# EAGLE design asset-tracker-v004 (EAGLE 7.6.0)
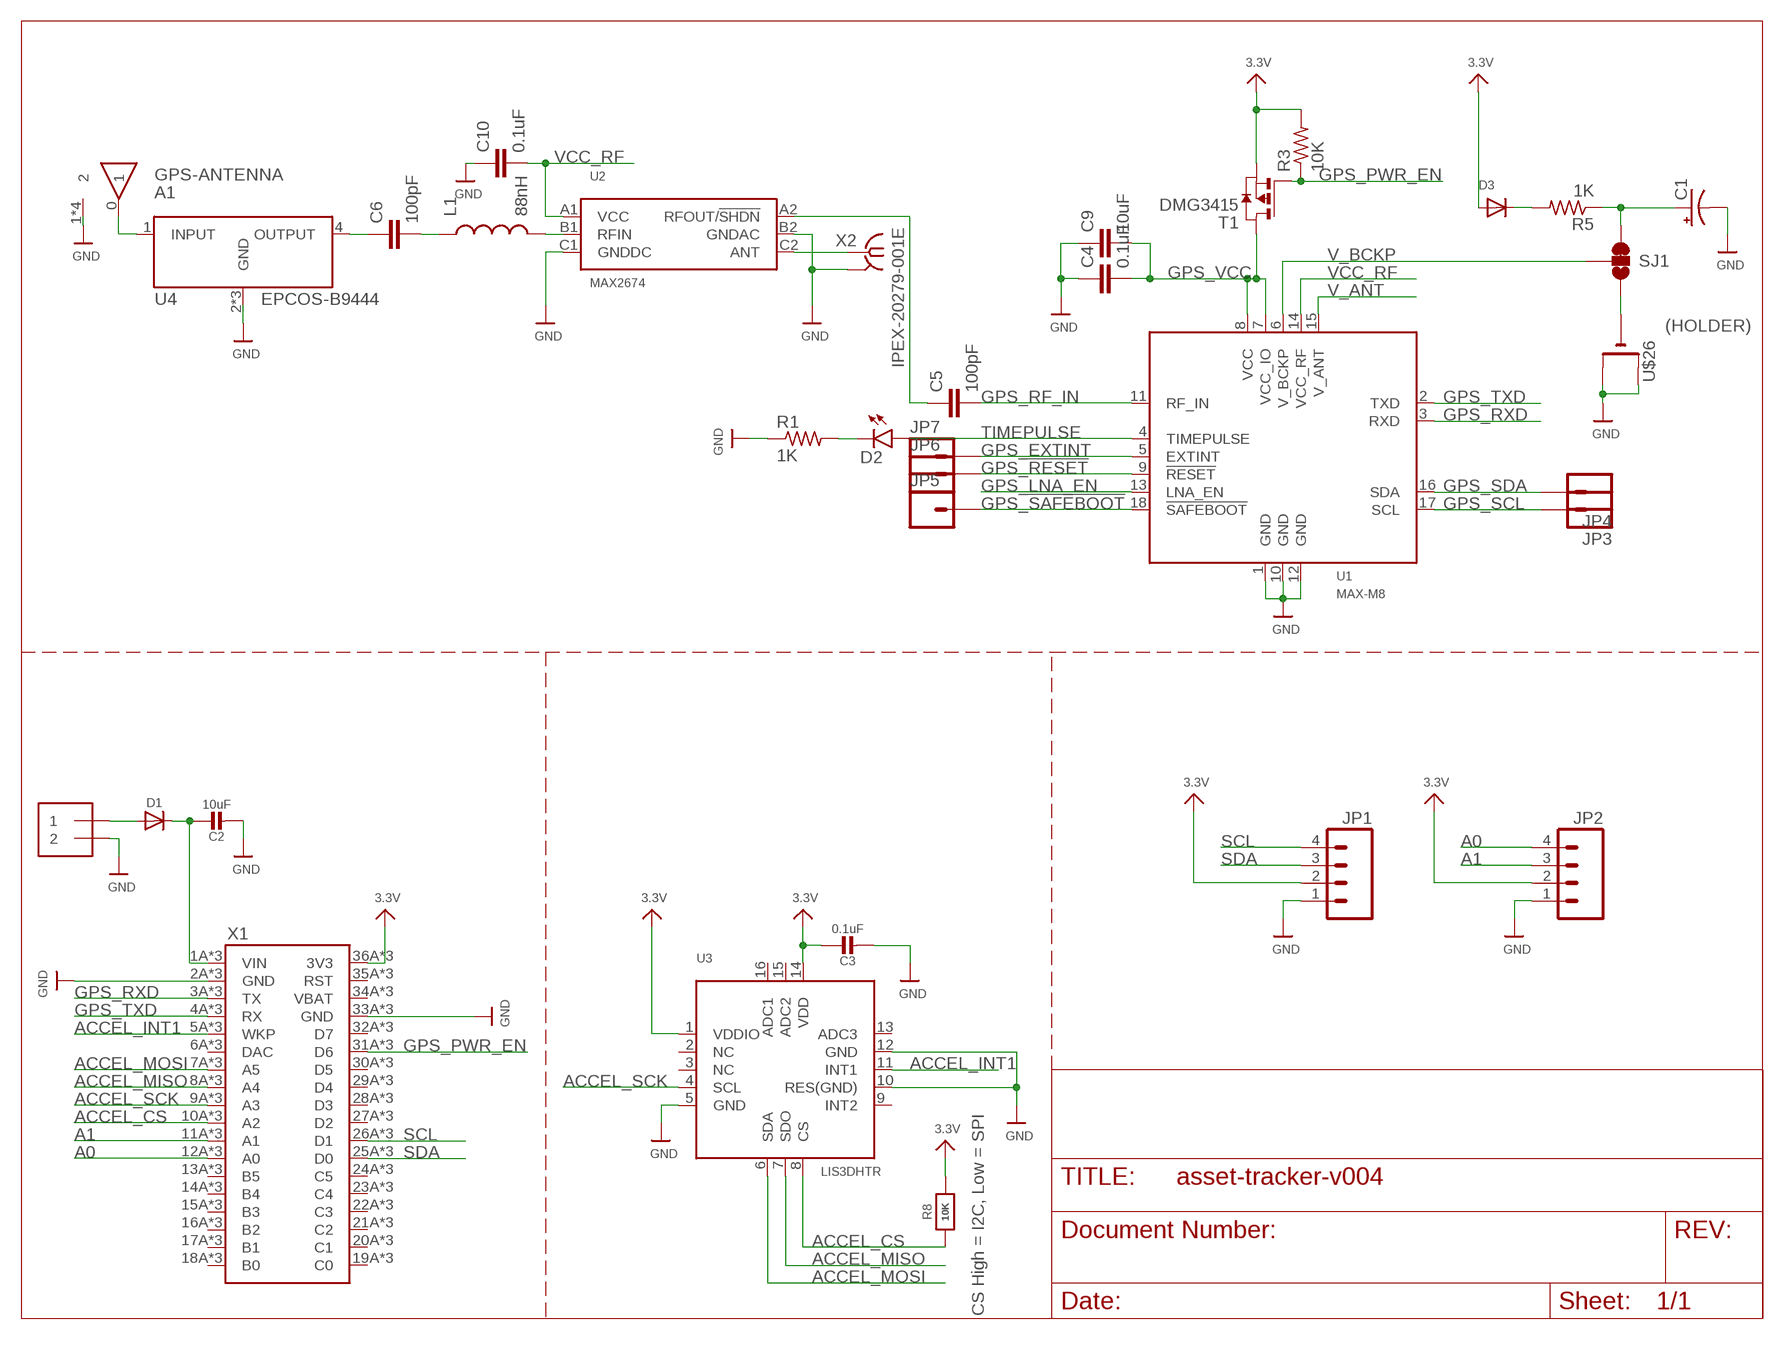
[diagram p0: schematic, sheet 1]

## Parts
A1  GPS-ANTENNA  [ANT1818B00BT1516S]
C1  SUPERCAP  [414-VA5R]
C2  10uF  CAP_CERAMIC_0402MP  [_0402MP]
C3  0.1uF  CAP_CERAMIC_0402MP  [_0402MP]
C4  0.1uF  C-EUC0402  [C0402]
C5  100pF  C-EUC0402  [C0402]
C6  100pF  C-EUC0402  [C0402]
C9  10uF  C-EUC0402  [C0402]
C10  0.1uF  C-EUC0402  [C0402]
D1  DIODESMA  [SMADIODE]
D2  LED0603  [LED-0603]
D3  DIODESOD-523  [SOD-523]
J1  1X2-3.5MM  [1X2-3.5MM]
JP1  M04JST-PTH-VERT  [JST-4-PTH-VERT]
JP2  M04JST-PTH-VERT  [JST-4-PTH-VERT]
JP3  M01NOSILK-KIT  [1X01NS-KIT]
JP4  M01NOSILK-KIT  [1X01NS-KIT]
JP5  M01NOSILK-KIT  [1X01NS-KIT]
JP6  M01NOSILK-KIT  [1X01NS-KIT]
JP7  M01NOSILK-KIT  [1X01NS-KIT]
L1  88nH  INDUCTOR-SPARKFUN0402  [C0402]
R1  1K  R-US_R0402  [R0402]
R3  10K  R-US_R0402  [R0402]
R5  1K  R-US_R0402  [R0402]
R8  10K  RESISTOR_0402MP  [_0402MP]
SJ1  JUMPER-PAD-3-2OF3_NC_BY_TRACE_LARGE  [PAD-JUMPER-3-2OF3_NC_BY_TRACE_YES_SILK_LARGE]
T1  DMG3415  PMOSSOT23  [SOT-23]
U1  MAX-M8  [MAX-M8]
U2  MAX2674  [WLP-6]
U3  LIS3DHTR  ACCEL_LIS3DHTR  [LGA16_3X3MM]
U4  EPCOS-B9444  [QCS5I]
U$26  CR2032SMT  [CR2032-SMD]
X1  ELECTRON  ELECTRON_SMT  [ELECTRON_SMT]
X2  IPEX-20279-001E  [IPEX-20279-001E]

## Nets
3.3V: C3.1 D3.A JP1.2 JP2.2 R3.2 R8.2 T1.2(S) U3.1(VDDIO) U3.14(VDD) X1.36A(3V3) X1.36B(3V3) X1.36C(3V3)
A0: JP2.4 X1.12A(A0) X1.12B(A0) X1.12C(A0)
A1: JP2.3 X1.11A(A1) X1.11B(A1) X1.11C(A1)
ACCEL_CS: R8.1 U3.8(CS) X1.10A(A2) X1.10B(A2) X1.10C(A2)
ACCEL_INT1: U3.11(INT1) X1.5A(WKP) X1.5B(WKP) X1.5C(WKP)
ACCEL_MISO: U3.7(SDO) X1.8A(A4) X1.8B(A4) X1.8C(A4)
ACCEL_MOSI: U3.6(SDA) X1.7A(A5) X1.7B(A5) X1.7C(A5)
ACCEL_SCK: U3.4(SCL) X1.9A(A3) X1.9B(A3) X1.9C(A3)
GND: A1.1 A1.2 A1.3 A1.4 C1.- C2.2 C3.2 C4.1 C9.1 C10.1 J1.2 JP1.1 JP2.1 R1.1 U1.1(GND) U1.10(GND) U1.12(GND) U2.B2(GNDAC) U2.C1(GNDDC) U3.5(GND) U3.10(RES(GND)) U3.12(GND) U4.2(GND) U4.3(GND) U4.5(GND) U$26.+$1(+) U$26.+$2(+1) X1.2A(GND) X1.2B(GND) X1.2C(GND) X1.33A(GND) X1.33B(GND) X1.33C(GND) X2.2@1(GND) X2.2@2(GND)
GPS_!RESET: JP6.1 U1.9(!RESET)
GPS_!SAFEBOOT: JP5.1 U1.18(!SAFEBOOT)
GPS_EXTINT: JP7.1 U1.5(EXTINT)
GPS_LNA_EN: U1.13(LNA_EN)
GPS_PWR_EN: R3.1 T1.3(G) X1.31A(D6) X1.31B(D6) X1.31C(D6)
GPS_RF_IN: C5.2 U1.11(RF_IN)
GPS_RXD: U1.3(RXD) X1.3A(TX) X1.3B(TX) X1.3C(TX)
GPS_SCL: JP3.1 U1.17(SCL)
GPS_SDA: JP4.1 U1.16(SDA)
GPS_TXD: U1.2(TXD) X1.4A(RX) X1.4B(RX) X1.4C(RX)
GPS_VCC: C4.2 C9.2 T1.1(D) U1.7(VCC_IO) U1.8(VCC)
N$1: C6.1 U4.4(OUTPUT)
N$2: L1.2 U2.B1(RFIN)
N$3: C6.2 L1.1
N$4: C5.1 U2.A2(RFOUT/!SHDN)
N$5: U2.C2(ANT) X2.1
N$6: D2.C R1.2
N$7: C1.+ R5.1 SJ1.3
N$8: C2.1 D1.C X1.1A(VIN) X1.1B(VIN) X1.1C(VIN)
N$9: D1.A J1.1
N$10: D3.K(C) R5.2
N$11: SJ1.1 U$26.-
N$12: A1.0 U4.1(INPUT)
SCL: JP1.4 X1.26A(D1) X1.26B(D1) X1.26C(D1)
SDA: JP1.3 X1.25A(D0) X1.25B(D0) X1.25C(D0)
TIMEPULSE: D2.A U1.4(TIMEPULSE)
V_ANT: U1.15(V_ANT)
V_BCKP: SJ1.2 U1.6(V_BCKP)
VCC_RF: C10.2 U1.14(VCC_RF) U2.A1(VCC)
Unconnected: U3.2(NC) U3.3(NC) U3.9(INT2) U3.13(ADC3) U3.15(ADC2) U3.16(ADC1) X1.6A(DAC) X1.6B(DAC) X1.6C(DAC) X1.13A(B5) X1.13B(B5) X1.13C(B5) X1.14A(B4) X1.14B(B4) X1.14C(B4) X1.15A(B3) X1.15B(B3) X1.15C(B3) X1.16A(B2) X1.16B(B2) X1.16C(B2) X1.17A(B1) X1.17B(B1) X1.17C(B1) X1.18A(B0) X1.18B(B0) X1.18C(B0) X1.19A(C0) X1.19B(C0) X1.19C(C0) X1.20A(C1) X1.20B(C1) X1.20C(C1) X1.21A(C2) X1.21B(C2) X1.21C(C2) X1.22A(C3) X1.22B(C3) X1.22C(C3) X1.23A(C4) X1.23B(C4) X1.23C(C4) X1.24A(C5) X1.24B(C5) X1.24C(C5) X1.27A(D2) X1.27B(D2) X1.27C(D2) X1.28A(D3) X1.28B(D3) X1.28C(D3) X1.29A(D4) X1.29B(D4) X1.29C(D4) X1.30A(D5) X1.30B(D5) X1.30C(D5) X1.32A(D7) X1.32B(D7) X1.32C(D7) X1.34A(VBAT) X1.34B(VBAT) X1.34C(VBAT) X1.35A(RST) X1.35B(RST) X1.35C(RST)

## Notes on the sheet
- (HOLDER)
- CS High = I2C, Low = SPI

## Library data of the parts
A1 = antenna:GPS-ANTENNA
C1 = adafruit:SUPERCAP
C2 C3 = microbuilder:CAP_CERAMIC: Ceramic Capacitors For new designs, use the packages preceded by an '_' character since they are more reliable: The following footprints should be used on most boards: _0402 - Standard footprint for regular board layouts _0603 - Standard footprint for regular board layouts _0805 - Standard footprint for regular board layouts _1206 - Standard footprint for regular board layouts For extremely tight-pitch boards where space is at a premium, the following 'micro-pitch' footprints can be used (smaller pads, no silkscreen outline, etc.): _0402MP - Micro-pitch footprint for very dense/compact boards _0603MP - Micro-pitch footprint for very dense/compact boards _0805MP - Micro-pitch footprint for very dense/compact boards _1206MP - Micro-pitch footprint for very dense/compact boards
C4-C6 C9 C10 = rcl:C-EU: CAPACITOR, European symbol
D1 = microbuilder:DIODE: Diode
D2 = SparkFun-LED:LED: LEDs Standard schematic elements and footprints for 5mm, 3mm, 1206, and 0603 sized LEDs. 5mm - Spark Fun Electronics SKU : COM-00529 (and others)
D3 = adafruit:DIODE: Diode
J1 = adafruit2:1X2: 3.5mm Terminal block http://www.ladyada.net/library/pcb/eaglelibrary.html
JP1 JP2 = SparkFun-Connectors:M04: Header 4 Standard 4-pin 0.1" header. Use with straight break away headers (SKU : PRT-00116), right angle break away headers (PRT-00553), swiss pins (PRT-00743), machine pins (PRT-00117), and female headers (PRT-00115). Molex polarized connector foot print use with SKU : PRT-08231 with associated crimp pins and housings. 1MM SMD Version SKU: PRT-10208
JP3-JP7 = SparkFun-Connectors:M01: Header 1 Standard 1-pin 0.1" header. Use with straight break away headers (SKU : PRT-00116), right angle break away headers (PRT-00553), swiss pins (PRT-00743), machine pins (PRT-00117), and female headers (PRT-00115). SMTSO-256-ET is a "flush mount" nut for a 4-40 screw. The older package used to be too tight, and did not allow it to sit properly thru the drill hit. The latest (0.165DIA) fits nice and snug.
L1 = Particle:INDUCTOR-SPARKFUN: Inductors Basic Inductor/Choke - 0603 and 1206. Footprints are not proven and vary greatly between part numbers. SRN6045- 33uH, 20% 1.4A
R1 R3 R5 = rcl:R-US_: RESISTOR, American symbol
R8 = microbuilder:RESISTOR: Resistors For new designs, use the packages preceded by an '_' character since they are more reliable: The following footprints should be used on most boards: _0402 - Standard footprint for regular board layouts _0603 - Standard footprint for regular board layouts _0805 - Standard footprint for regular board layouts _1206 - Standard footprint for regular board layouts For extremely tight-pitch boards where space is at a premium, the following 'micro-pitch' footprints can be used (smaller pads, no silkscreen outline, etc.): _0402MP - Micro-pitch footprint for very dense/compact boards _0603MP - Micro-pitch footprint for very dense/compact boards _0805MP - Micro-pitch footprint for very dense/compact boards _1206MP - Micro-pitch footprint for very dense/compact boards
SJ1 = SparkFun-Passives:JUMPER-PAD-3-2OF3_NC_BY_TRACE
T1 = zetex:PMOSSOT23: MOS FET; OC_FARNELL: unknown; OC_NEWARK: unknown
U1 = u-blox:MAX-M8
U2 = maxim:MAX2674: GPS/GNSS LNAs with Antenna Switch and Bias
U3 = microbuilder:ACCEL_LIS3DHTR: LIS3DHTR 3-Axis Accelerometer with I2C/SPI Interface VDD: 1.71-3.6V VDDIO: 1.71-VDD+0.1V Scale: +/-2g, 4g, 8g, 16g with 16--bit data output Temp:: -40°C - 85°C Mouser: 511-LIS3DHTR Digikey: 497-10613-1-ND
U4 = filters:EPCOS-B9444
U$26 = adafruit:CR2032
X1 = microbuilder:ELECTRON
X2 = Particle:IPEX-20279-001E: Ultra Miniature Coaxial SMT RF Receptacle

## Board
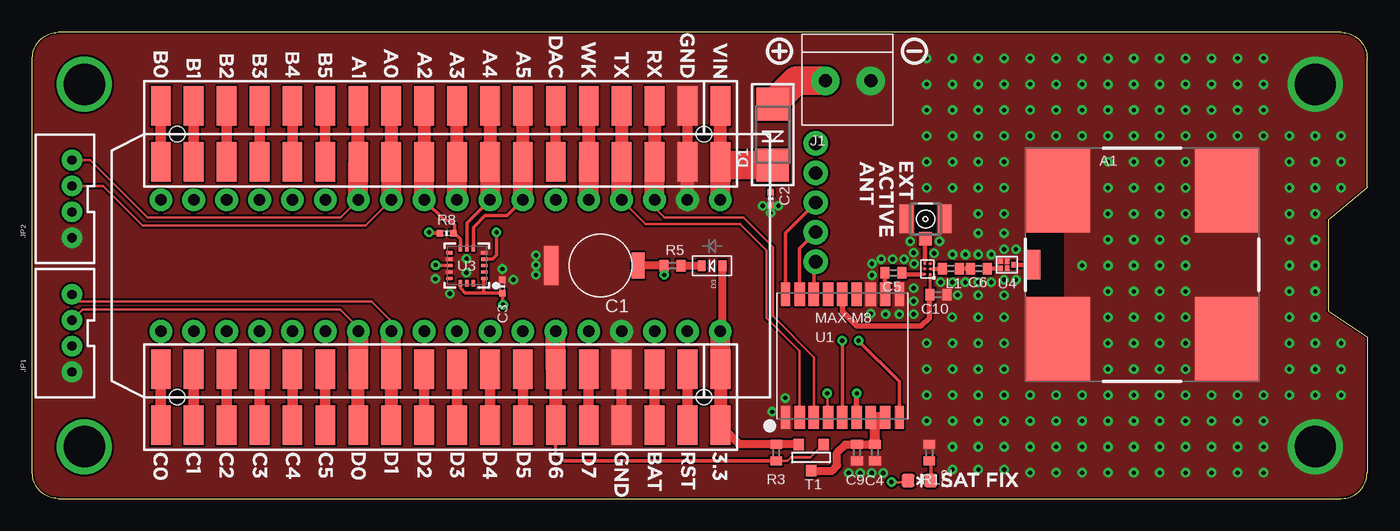
[diagram p1: board, top side]
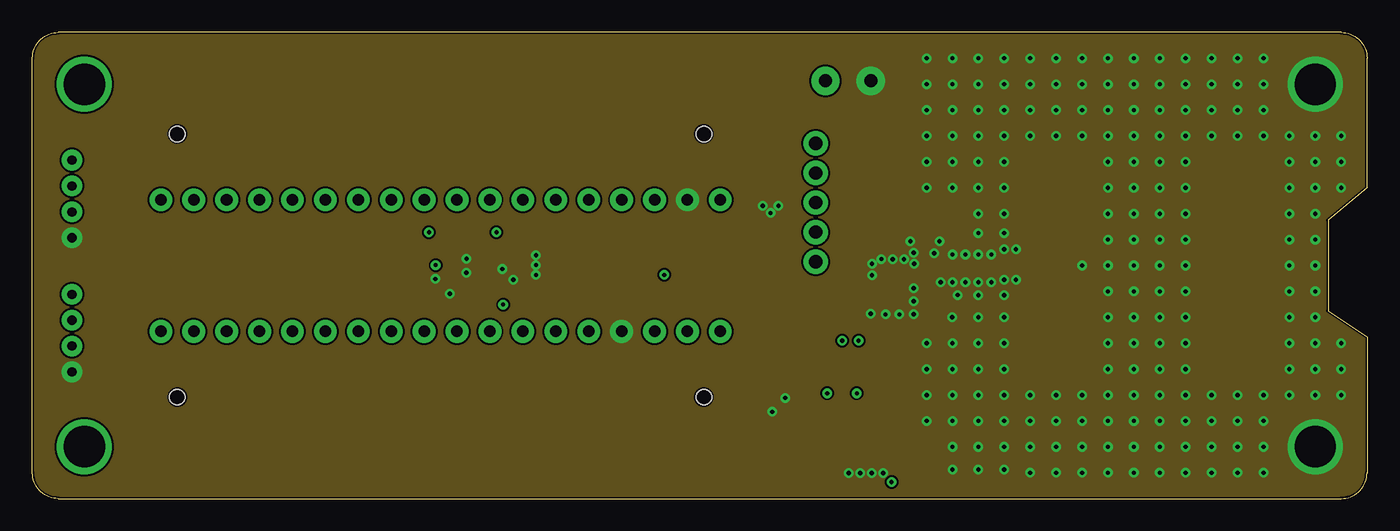
[diagram p2: board, inner layer Route2]
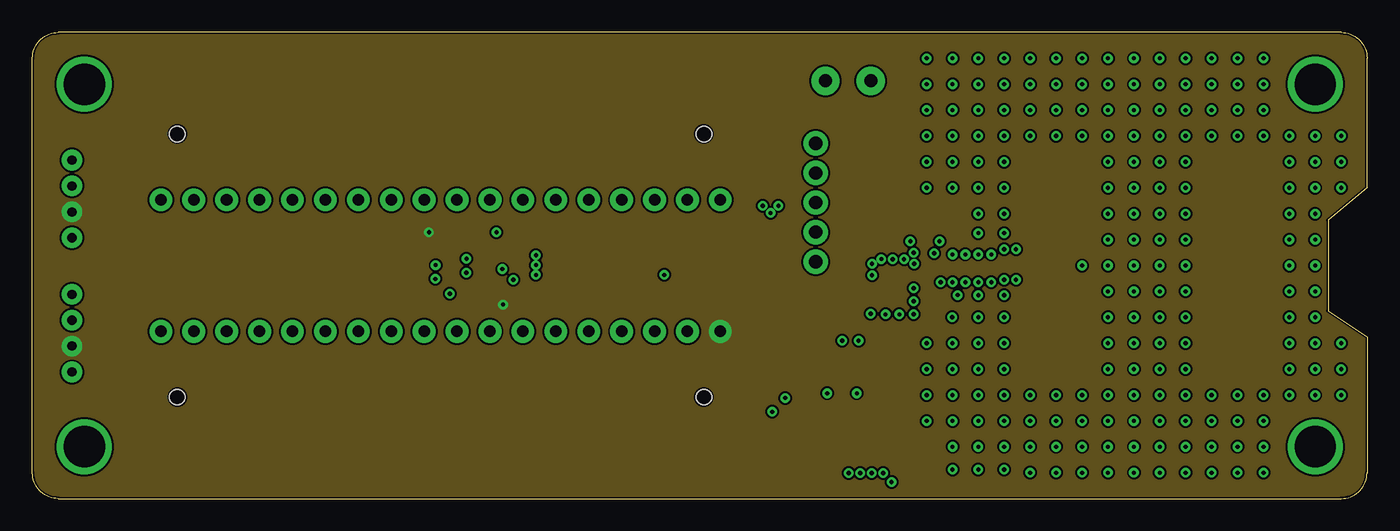
[diagram p3: board, inner layer Route15]
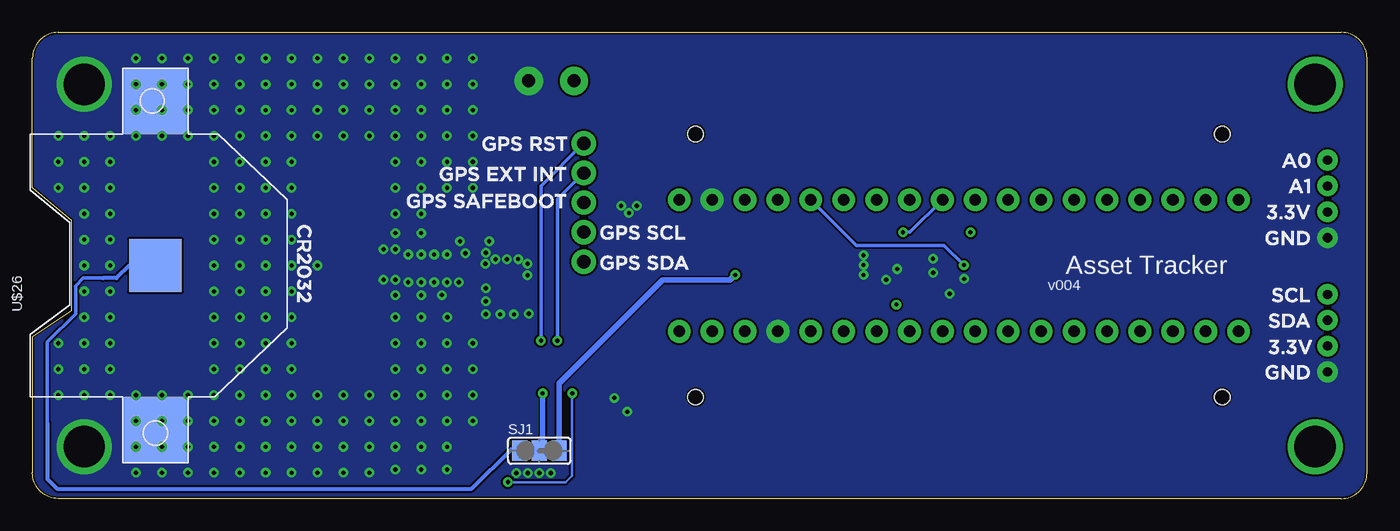
[diagram p4: board, bottom side, seen from below]

Size 103 x 36 mm. Coordinates in mm from the lower left corner, seen from the top.
Outline: 103,2 arc-90 101,0 2,0 arc-90 0,2 0,34 arc-90 2,36 101,36 arc-90 103,34
Outline: 103,34 103,24 100,21.5 100,14.5 103,12.5 103,2
Copper layers (1+2*15+16): Top 0.018mm / dielectric 0.195mm / Route2 0.035mm / dielectric 1.1mm / Route15 0.035mm / dielectric 0.195mm / Bottom 0.018mm
Design rules "spark-4layer": minimum track width 6mil, minimum drill 0.3mm, track to track 6mil, track to pad 6mil, pad to pad 6mil, via to via 6mil, smd to smd 6mil, copper to edge 6mil, drill to drill 6mil, minimum pad ring 12mil, minimum via ring 8mil, stop-mask expansion 4mil, vias tented up to drill 20mil, thermal gap 8mil
tRestrict: area 68.1,20.4 to 69.8,22.8; area 70.7,17.1 to 71.1,18.4; area 72.8,17.1 to 73.3,18.4; area 66.2,16.8 to 66.6,18.1

### Footprints (pad centres in the part's own frame; a part is rotated, then mirrored left to right if it is on the bottom)
ANT1818B00BT1516S = smd 2.3 x 1.2: 0 0,-8.45 | smd 6.5 x 5: 1 -5.75,-6.55; 2 5.75,-6.55; 3 5.75,6.55; 4 -5.75,6.55
414-VA5R = smd 1 x 2: + -2.9,0 | smd 1.1 x 3: - 3.8,0
_0402MP = smd 0.5 x 0.5: 1 -0.508,0; 2 0.508,0
C0402 = smd 0.7 x 0.9: 1 -0.65,0; 2 0.65,0
SMADIODE = smd 2.54 x 2.54: A 2.349,0; C -2.349,0
LED-0603 = smd 1 x 1: A 0,-0.877; C 0,0.877
SOD-523 = smd 0.8 x 0.6: A 0,-0.8; K 0,0.8
1X2-3.5MM = drill 1 pad 2.184: 1 1.8,0; 2 -1.7,0
JST-4-PTH-VERT = drill 0.7 pad 1.6: 1 -3,-0.55; 2 -1,-0.55; 3 1,-0.55; 4 3,-0.55
1X01NS-KIT = drill 1.016 pad 1.88: 1 0,0
R0402 = smd 0.7 x 0.9: 1 -0.65,0; 2 0.65,0
PAD-JUMPER-3-2OF3_NC_BY_TRACE_YES_SILK_LARGE = smd 1.168 x 1.6: 1 -1.524,0; 2 0,0; 3 1.524,0
SOT-23 = smd 0.787 x 0.889: 1 0.025,-1.016; 2 -0.94,1.016; 3 0.991,1.016
MAX-M8 = smd 1.8 x 0.7: 1 4.75,-4.4; 9 4.75,4.4; 10 -4.75,4.4; 18 -4.75,-4.4 | smd 1.8 x 0.8: 2 4.75,-3.3; 3 4.75,-2.2; 4 4.75,-1.1; 5 4.75,0; 6 4.75,1.1; 7 4.75,2.2; 8 4.75,3.3; 11 -4.75,3.3; 12 -4.75,2.2; 13 -4.75,1.1; 14 -4.75,0; 15 -4.75,-1.1; 16 -4.75,-2.2; 17 -4.75,-3.3
WLP-6 = smd 0.229 x 0.229: A1 -0.2,0.4; A2 0.2,0.4; B1 -0.2,0; B2 0.2,0; C1 -0.2,-0.4; C2 0.2,-0.4
LGA16_3X3MM = smd 0.5 x 0.25: 1 -1.35,1; 2 -1.35,0.5; 3 -1.35,0; 4 -1.35,-0.5; 5 -1.35,-1; 9 1.35,-1; 10 1.35,-0.5; 11 1.35,0; 12 1.35,0.5; 13 1.35,1 | smd 0.25 x 0.5: 6 -0.5,-1.35; 7 0,-1.35; 8 0.5,-1.35; 14 0.5,1.35; 15 0,1.35; 16 -0.5,1.35
QCS5I = smd 0.35 x 0.425: 1 -0.5,0; 2 0,-0.287; 3 0.5,-0.287; 4 0.5,0.287; 5 0,0.287
CR2032-SMD = smd 5.08 x 5.08: +$1 -12.7,0; +$2 12.7,0 | smd 4.064 x 4.064: - 0,0
ELECTRON_SMT = smd 3.048 x 1.524: 1A -12.319,21.59; 1B -8.001,21.59; 2A -12.319,19.05; 2B -8.001,19.05; 3A -12.319,16.51; 3B -8.001,16.51; 4A -12.319,13.97; 4B -8.001,13.97; 5A -12.319,11.43; 5B -8.001,11.43; 6A -12.319,8.89; 6B -8.001,8.89; 7A -12.319,6.35; 7B -8.001,6.35; 8A -12.319,3.81; 8B -8.001,3.81; 9A -12.319,1.27; 9B -8.001,1.27; 10A -12.319,-1.27; 10B -8.001,-1.27; 11A -12.319,-3.81; 11B -8.001,-3.81; 12A -12.319,-6.35; 12B -8.001,-6.35; 13A -12.319,-8.89; 13B -8.001,-8.89; 14A -12.319,-11.43; 14B -8.001,-11.43; 15A -12.319,-13.97; 15B -8.001,-13.97; 16A -12.319,-16.51; 16B -8.001,-16.51; 17A -12.319,-19.05; 17B -8.001,-19.05; 18A -12.319,-21.59; 18B -8.001,-21.59; 19A 12.319,-21.59; 19B 8.001,-21.59; 20A 12.319,-19.05; 20B 8.001,-19.05; 21A 12.319,-16.51; 21B 8.001,-16.51; 22A 12.319,-13.97; 22B 8.001,-13.97; 23A 12.319,-11.43; 23B 8.001,-11.43; 24A 12.319,-8.89; 24B 8.001,-8.89; 25A 12.319,-6.35; 25B 8.001,-6.35; 26A 12.319,-3.81; 26B 8.001,-3.81; 27A 12.319,-1.27; 27B 8.001,-1.27; 28A 12.319,1.27; 28B 8.001,1.27; 29A 12.319,3.81; 29B 8.001,3.81; 30A 12.319,6.35; 30B 8.001,6.35; 31A 12.319,8.89; 31B 8.001,8.89; 32A 12.319,11.43; 32B 8.001,11.43; 33A 12.319,13.97; 33B 8.001,13.97; 34A 12.319,16.51; 34B 8.001,16.51; 35A 12.319,19.05; 35B 8.001,19.05; 36A 12.319,21.59; 36B 8.001,21.59 | drill 0.889 pad 1.753: 1C -5.08,21.59; 2C -5.08,19.05; 3C -5.08,16.51; 4C -5.08,13.97; 5C -5.08,11.43; 6C -5.08,8.89; 7C -5.08,6.35; 8C -5.08,3.81; 9C -5.08,1.27; 10C -5.08,-1.27; 11C -5.08,-3.81; 12C -5.08,-6.35; 13C -5.08,-8.89; 14C -5.08,-11.43; 15C -5.08,-13.97; 16C -5.08,-16.51; 17C -5.08,-19.05; 18C -5.08,-21.59; 19C 5.08,-21.59; 20C 5.08,-19.05; 21C 5.08,-16.51; 22C 5.08,-13.97; 23C 5.08,-11.43; 24C 5.08,-8.89; 25C 5.08,-6.35; 26C 5.08,-3.81; 27C 5.08,-1.27; 28C 5.08,1.27; 29C 5.08,3.81; 30C 5.08,6.35; 31C 5.08,8.89; 32C 5.08,11.43; 33C 5.08,13.97; 34C 5.08,16.51; 35C 5.08,19.05; 36C 5.08,21.59 | hole 1.2: -10.16,20.32; 10.16,20.32; 10.16,-20.32; -10.16,-20.32
IPEX-20279-001E = smd 1 x 1.05: 1 0,1.528 | smd 1.05 x 2.2: 2@1 -1.475,0; 2@2 1.475,0

### Placement (x,y rotation side)
A1  85.64,18.06 270 top
C1  43.84,17.99 180 top
C2  56.97,23.16 270 top
C3  36.28,16.38 90 top
C4  65.03,3.55 90 top
C5  66.44,17.43 180 top
C6  73.05,17.76 180 top
C9  63.63,3.55 90 top
C10  69.91,15.74 180 top
D1  57.13,28.1 90 top
D2  68.45,1.4 270 top
D3  52.46,17.99 90 top
J1  63,32.26 180 top
JP1  2.5,12.77 90 top
JP2  2.5,23.14 90 top
JP3  60.45,20.57 0 top
JP4  60.45,18.29 0 top
JP5  60.45,22.86 0 top
JP6  60.45,27.43 0 top
JP7  60.45,25.14 0 top
L1  70.87,17.76 180 top
R1  69.22,3.55 270 top
R3  57.41,3.55 90 top
R5  49.4,17.99 0 top
R8  31.96,20.5 180 top
SJ1  63.88,3.7 0 bottom
T1  60.07,3.17 0 top
U1  62.5,11.03 270 top
U2  69.07,17.73 180 top
U3  33.53,17.99 180 top
U4  75.21,18.05 180 top
U$26  93.5,18 90 bottom
X1  31.5,17.99 270 top
X2  68.93,21.59 180 top

### Tracks (layer width: path | path; a pad name or v marks a point on that pad's centre or on a via)
3.3V  (via drill 0.33)
  Top 0.254: C3.1 | U3.14 33.03,16.25 33.4,15.87 33.41,15.88 34.8,15.88 | 34.8,15.88 C3.1 | U3.1 34.8,16.91 34.8,15.88 | R8.2 30.69,20.5 v30.61,20.57 | C3.1 36.28,15.03 v36.32,14.98
  Top 0.61: T1.2 57.42,4.19 R3.2 54.56,4.2 X1.36A | X1.36C 53.26,13.08 D3.A
  Top 1.016: X1.36B X1.36A
  Top 1.524: X1.36B X1.36C
  pour Route15 (no thermals): 0,0 104.14,0 104.14,36.83 0,36.83
A0
  Top 0.203: X1.12C 23.8,21.71 8.89,21.71 4.46,26.14 JP2.4
  Top 1.016: X1.12B X1.12A
  Top 1.524: X1.12C X1.12B
A1
  Top 0.203: X1.11C 25.7,21.08 8.51,21.08 5.45,24.14 JP2.3
  Top 1.016: X1.11A X1.11B
  Top 1.524: X1.11A | X1.11B X1.11C
ACCEL_CS
  Top 0.254: U3.8 33.03,20.06 32.59,20.5 | 32.59,20.5 32.59,21.13 32.26,21.46 31.84,21.46 X1.10C | 32.59,20.5 R8.1
  Top 1.016: X1.10A 30.23,26.67 30.23,26.66 X1.10B
  Top 1.524: X1.10C X1.10B
ACCEL_INT1  (via drill 0.33)
  Top 0.254: U3.11 31.16,17.99 v31.12,18.03
  Top 1.016: X1.5A X1.5B
  Top 1.524: X1.5B X1.5C
  Bottom 0.254: X1.5C 39.42,19.56 32.64,19.56 v31.12,18.03
ACCEL_MISO
  Top 0.254: U3.7 33.53,21.29 X1.8C
  Top 1.016: X1.8A X1.8B
  Top 1.524: X1.8B X1.8C
ACCEL_MOSI
  Top 0.254: U3.6 34.03,20.94 34.93,21.84 36.62,21.84 X1.7C
  Top 1.016: X1.7B X1.7A
  Top 1.524: X1.7C X1.7B
ACCEL_SCK  (via drill 0.33)
  Top 0.254: U3.4 35.51,18.49 35.82,18.79 v35.82,20.57
  Top 1.016: X1.9B X1.9A
  Top 1.524: X1.9C X1.9B
  Bottom 0.254: v35.82,20.57 35.27,20.57 X1.9C
GND  (via drill 0.33, 3.2)
  Top 1.016: X1.2C X1.2B
  other vias: 36.27,17.73 37.11,16.89 33.5,18.51 32.21,15.82 38.86,18.03 31.09,16.97 58.09,7.77 57.1,6.7 64.7,14.27 65.84,14.22 66.91,14.22 64.8,18.13 71.4,15.72 33.48,17.45 77,28 79,28 81,28 83,28 85,28 87,28 89,28 91,28 93,28 95,28 97,28 99,28 101,28 77,8 79,8 81,8 83,8 85,8 87,8 89,8 93,8 95,8 97,8 99,8 101,8 77,6 79,6 81,6 83,6 85,6 87,6 93,6 95,6 95,4 93,4 91,4 89,4 77,30 79,30 81,30 83,30 85,30 87,30 89,30 91,30 93,30 95,30 95,32 93,32 91,32 89,32 87,32 85,32 83,32 81,32 79,32 77,32 77,34 79,34 81,34 83,34 85,34 87,34 89,34 91,34 93,34 95,34 75,28 73,28 71,28 71,30 71,32 71,34 73,34 73,32 73,30 75,30 75,32 75,34 75,26 73,26 71,26 75,24 73,24 71,24 75,22 73,22 75,14 75,12 75,10 75,8 75,6 73,6 71,6 71,8 73,8 73,10 71,10 71,12 73,12 73,14 97,26 99,26 101,26 97,24 99,24 97,22 97,20 97,18 97,16 97,14 97,12 97,10 99,10 101,10 99,12 89,2 87,2 85,2 83,2 81,2 79,2 77,2 75,2.25 73,2.25 71,2.25 91,2 93,2 95,2 69,34 69,32 69,30 69,28 69,26 69,24 69,8 69,10 69,12 73,18.85 74,18.85 75,19.25 72,18.85 71,18.85 69.6,18.95 70.1,16.7 71,16.7 72,16.7 73,16.7 74,16.7 75,16.9 75,15.7 73,15.7 89,6 91,6 91,8 87,4 85,4 83,4 81,4 79,4 77,4 75,4 73,4 71,4 99,32 99,4 75.9,19.25 75.9,16.9 99,22 99,20 99,18 99,16 99,14 101,12 101,24 83,26 85,26 87,26 89,26 89,24 87,24 85,24 83,24 83,22 85,22 87,22 89,22 89,20 87,20 85,20 83,20 83,18 83,16 83,14 83,12 83,10 85,10 87,10 89,10 89,12 87,12 85,12 85,14 87,14 89,14 89,16 87,16 85,16 85,18 87,18 89,18 81,18 64.77,1.98 63.88,1.98 69,6 68.05,18.14 67.26,18.49 66.39,18.49 65.51,18.5 68,16.25 68,15.25 68,14.25 73,20.5 75,20.5 68.01,18.98 56.35,22.61 56.96,22.05 64.8,17.24 62.99,1.98 65.66,1.98 67.75,19.87 70,19.86 70.97,14 57.57,22.61 38.86,18.79 38.86,17.27
  pour Bottom (no thermals): 0,0 0,36.83 104.14,36.83 104.14,0
  pour Top (no thermals): 0,0 104.14,0 104.14,36.83 0,36.83
  pour Route2 (no thermals): 0,0 0,36.83 104.14,36.83 104.14,0
GPS_!RESET  (via drill 0.33)
  Top 0.254: U1.9 66.9,9.04 v63.76,12.19
  Bottom 0.254: v63.76,12.19 63.76,24.13 JP6.1
GPS_!SAFEBOOT
  Top 0.254: U1.18 58.1,20.51 JP5.1
GPS_EXTINT  (via drill 0.33)
  Top 0.254: U1.5 62.5,12.17 v62.49,12.19
  Bottom 0.254: v62.49,12.19 62.49,23.11 JP7.1
GPS_PWR_EN
  Top 0.203: 57.39,2.92 R3.1 58.28,2.9 58.55,3.17 60.05,3.17 T1.3
  Top 0.254: 57.39,2.92 41.02,2.92 40.39,3.55 X1.31A
  Top 0.305: X1.31A
  Top 1.016: X1.31B 40.39,6.09 X1.31A
  Top 1.524: X1.31B X1.31C
GPS_RF_IN
  Top 0.349: U1.11 C5.2
  Top 0.432: U1.11
GPS_RXD
  Top 0.203: X1.3C 48.01,22.47 48.77,21.71 54.87,21.71 57.15,19.43 57.15,14.09 60.33,10.92 60.33,6.3 U1.3
  Top 1.016: 48.01,29.72 48.01,29.71 X1.3B
  Top 1.524: X1.3C X1.3B | 48.01,29.72 X1.3A
GPS_SCL
  Top 0.254: U1.17 59.2,19.32 JP3.1
GPS_SDA
  Top 0.254: U1.16 60.3,18.13 JP4.1
GPS_TXD
  Top 0.203: U1.2 59.2,11.41 56.64,13.97 56.64,19.18 54.61,21.21 47.34,21.21 X1.4C
  Top 1.016: X1.4A X1.4B
  Top 1.524: X1.4C X1.4B
GPS_VCC
  Top 0.61: C4.2 C9.2 63.61,4.19 62.74,4.19 62.11,3.55 62.11,2.54 61.72,2.16 T1.1
  Top 0.762: C4.2 65.03,6.28 U1.7
  Top 0.813: U1.8 U1.7
N$1
  Top 0.338: U4.4
  Top 0.349: C6.1 U4.4
N$2
  Top 0.203: U2.B1 69.37,17.73 69.5,17.73
  Top 0.338: 70.22,17.73 L1.2 70.22,17.73
  Top 0.349: 69.5,17.73 70.22,17.73
N$3
  Top 0.349: L1.1 C6.2
N$4
  Top 0.203: U2.A2 68.58,17.33 68.66,17.32
  Top 0.338: 67.09,17.33 C5.1 67.09,17.32
  Top 0.349: 68.66,17.32 67.09,17.32
N$5
  Top 0.203: U2.C2 68.86,18.13 68.86,18.39
  Top 0.338: 68.86,20 X2.1
  Top 0.349: 68.86,18.39 68.86,20
N$6
  Top 0.254: D2.C 69.33,2.79 R1.2
N$7  (via drill 0.33)
  Top 0.61: C1.+ R5.1 48.75,17.29 v48.77,17.27
  Bottom 0.406: SJ1.3 62.36,8.89 54.36,16.89 49.15,16.89 v48.77,17.27
N$8
  Top 0.254: C2.1 56.97,25.59 D1.C
  Top 0.813: 53.6,25.7 53.39,25.7 X1.1B
  Top 1.016: X1.1B X1.1A
  Top 1.524: X1.1C X1.1B
  Top 2.184: D1.C 53.65,25.75 53.6,25.7
N$9
  Top 2.184: J1.1 58.94,32.26 D1.A
N$10
  Top 0.61: R5.2 D3.K
N$11
  Bottom 0.254: 97.54,17.02 99.06,17.02 99.67,16.41 99.67,14.27 101.86,12.09 101.86,5.84
  Bottom 0.305: U$26.- 95.54,18 96.52,17.02 97.54,17.02 | 101.86,5.84 101.86,1.52 101.09,0.76 69.09,0.76 66.04,3.81 65.51,3.81 SJ1.1
N$12
  Top 0.305: U4.1
  Top 0.338: A1.0
  Top 0.349: U4.1 A1.0
N$13
  Top 0.813: 9.91,27.18 9.91,28.95
N$14
  Top 0.813: 12.45,28.95 12.45,27.43
N$15  (via drill 3.2)
  other vias: 4,4
N$16  (via drill 3.2)
  other vias: 4,32
N$17
  Top 0.813: 14.99,28.95 14.99,27.43
N$18
  Top 0.813: 17.53,28.95 17.53,27.43
N$19
  Top 0.813: 20.07,28.95 20.07,27.43
N$20
  Top 0.813: 22.61,28.95 22.61,27.43
N$21
  Top 0.813: 40.39,28.95 40.39,27.43
N$22
  Top 0.813: 50.55,28.95 50.55,27.43
N$23
  Top 0.813: 9.91,6.86 9.91,8.63
N$24
  Top 0.813: 12.45,8.89 12.45,7.11
N$25
  Top 0.813: 14.99,8.63 14.99,7.11
N$26
  Top 0.813: 17.53,8.63 17.53,7.11
N$27
  Top 0.813: 20.07,8.63 20.07,7.11
N$28
  Top 0.813: 22.61,8.63 22.61,7.11
N$29
  Top 0.813: 30.23,8.63 30.23,7.11
N$30
  Top 0.813: 32.77,8.63 32.77,7.11
N$31
  Top 0.813: 35.31,8.63 35.31,7.11
N$32
  Top 0.813: 37.85,8.63 37.85,7.11
N$33
  Top 0.813: 42.93,8.63 42.93,7.11
N$34
  Top 0.813: 45.47,8.63 45.47,7.11
N$35
  Top 0.813: 48.01,8.63 48.01,7.11
N$36
  Top 0.813: 50.55,8.63 50.55,7.11
SCL
  Top 0.203: X1.26C 27.69,13.71 26.16,15.24 3.59,15.24 JP1.4
  Top 1.016: X1.26B X1.26A
  Top 1.524: X1.26B X1.26C
SDA
  Top 0.203: X1.25C 25.15,13.2 23.75,14.6 3.88,14.6 JP1.3
  Top 1.016: X1.25A X1.25B
  Top 1.524: X1.25C X1.25B
TIMEPULSE  (via drill 0.33)
  Top 0.203: U1.4 61.34,6.33 v61.34,8.13 | v66.3,1.27 67.45,1.27 D2.A
  Bottom 0.203: v66.3,1.27 61.85,1.27 61.34,1.78 v61.34,8.13
V_BCKP  (via drill 0.33)
  Top 0.406: U1.6 63.6,8.1 v63.63,8.13
  Bottom 0.406: v63.63,8.13 63.63,3.95 SJ1.2
VCC_RF
  Top 0.203: 69.27,15.75 C10.2
  Top 0.229: U2.A1 69.27,15.75
  Top 0.406: U1.14 62.5,14.46 63.63,13.33 68.58,13.33 69.22,13.97 69.22,15.29 C10.2

### Text on the board
bPlace: Asset Tracker | v004
Reference: BATTERY | ANTENNA